# EAGLE design pcb (EAGLE 9.6.2)
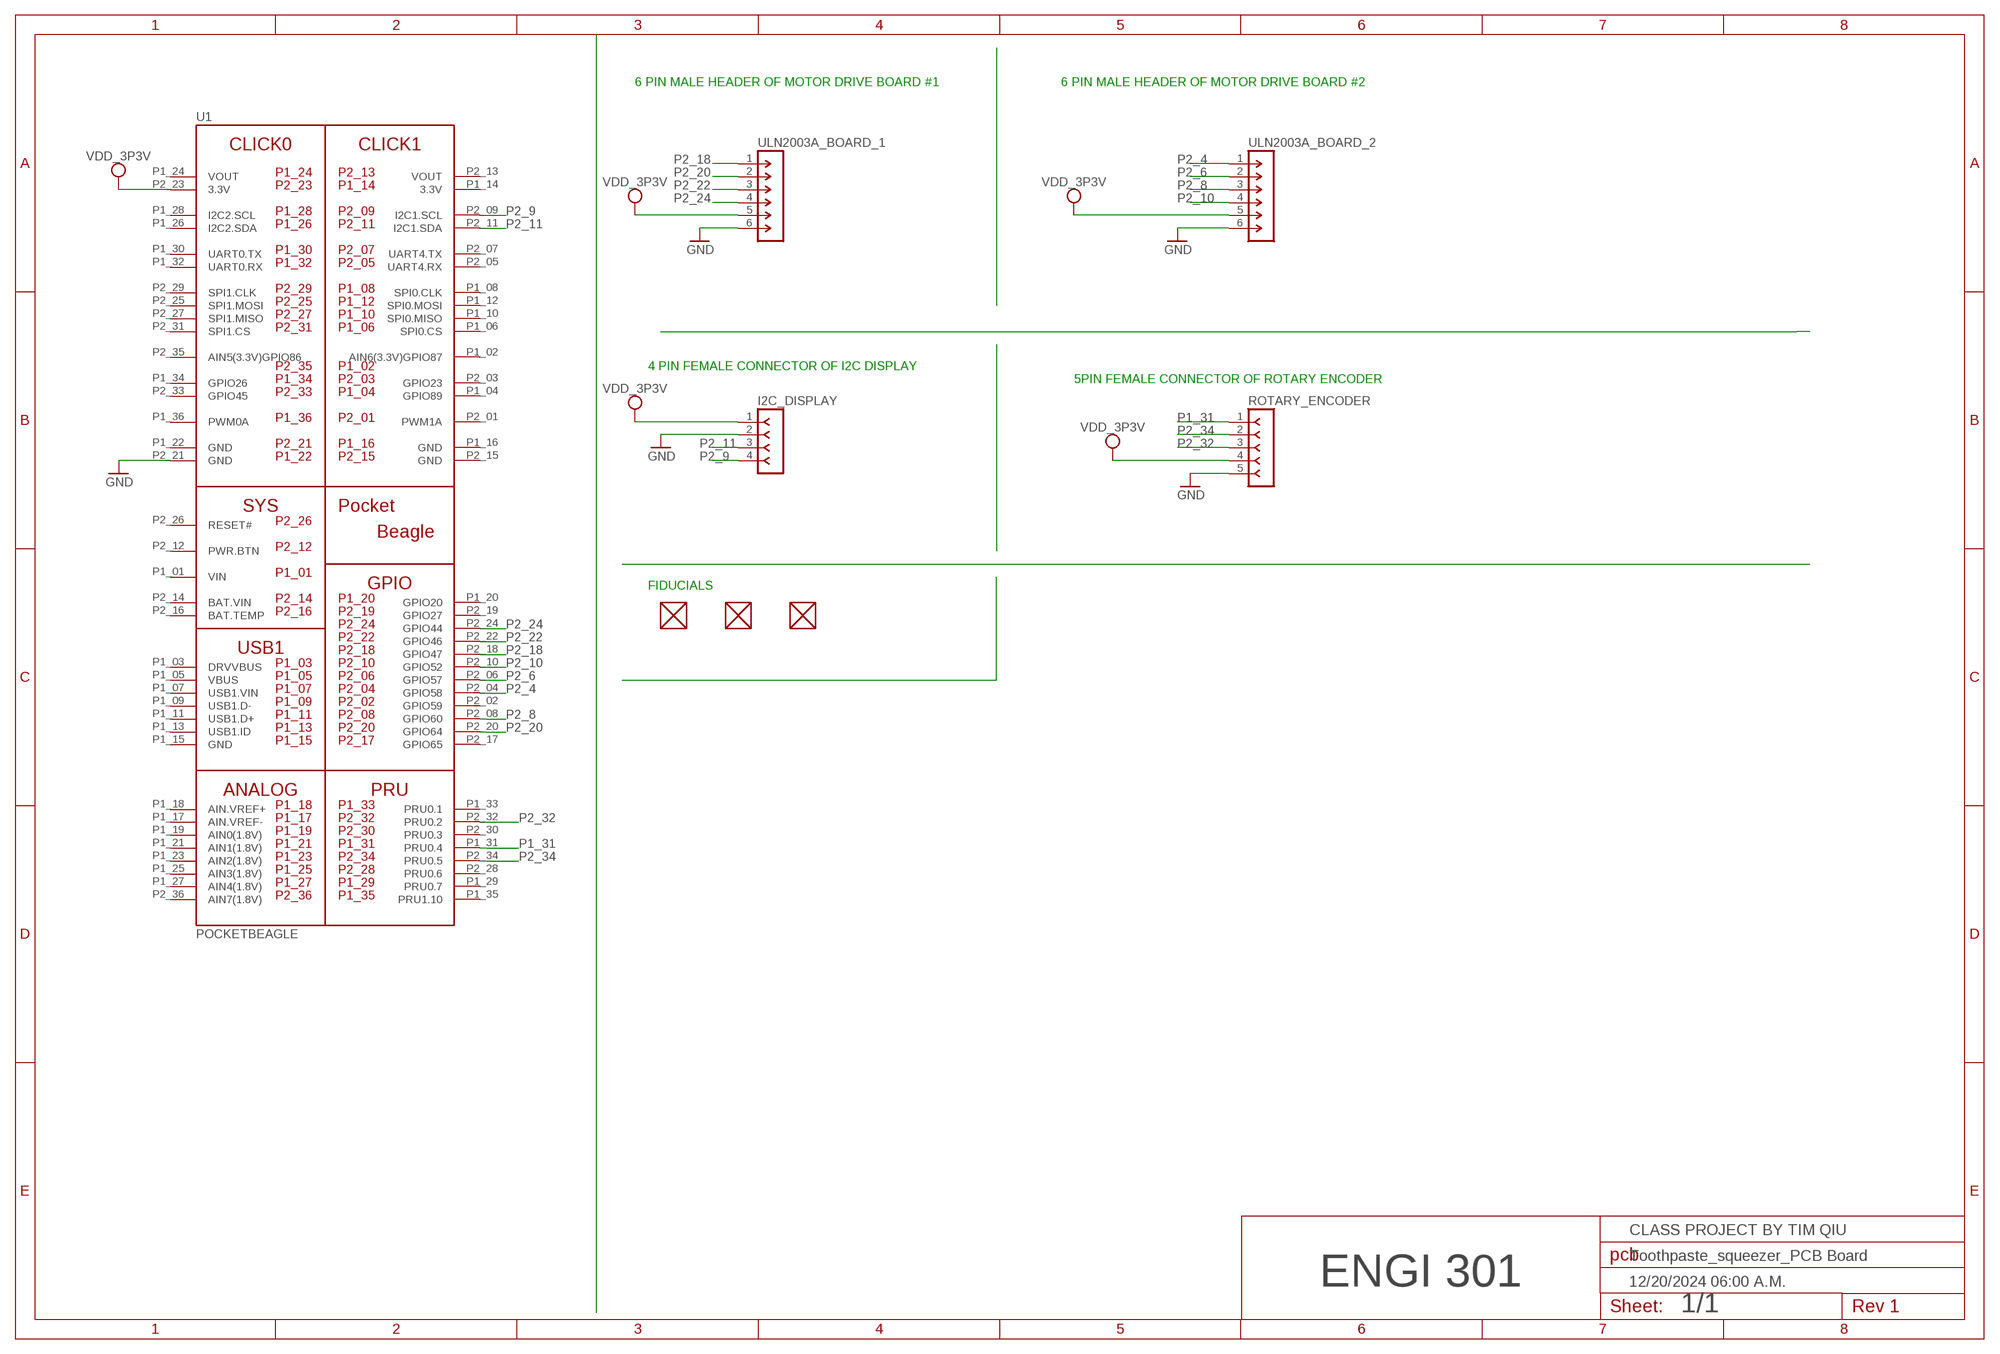
[diagram p0: schematic, sheet 1]

## Parts
FUD1  FIDUCIAL  [FIDUCIAL_40MIL]
FUD2  FIDUCIAL  [FIDUCIAL_40MIL]
FUD3  FIDUCIAL  [FIDUCIAL_40MIL]
I2C_DISPLAY  F-1X04-SIP-100-32  [SIP-100-04-32]
ROTARY_ENCODER  F-1X05-SIP-100-32  [SIP-100-05-32]
U1  POCKETBEAGLE  [POCKETBEAGLE]
ULN2003A_BOARD_1  M-1X06-SIP-100-32  [SIP-100-06-32]
ULN2003A_BOARD_2  M-1X06-SIP-100-32  [SIP-100-06-32]

## Nets
GND: I2C_DISPLAY.2 ROTARY_ENCODER.5 U1.P2_21(GND) ULN2003A_BOARD_1.6 ULN2003A_BOARD_2.6
P1_31: ROTARY_ENCODER.1 U1.P1_31(PRU0.4)
P2_4: U1.P2_04(GPIO58) ULN2003A_BOARD_2.1
P2_6: U1.P2_06(GPIO57) ULN2003A_BOARD_2.2
P2_8: U1.P2_08(GPIO60) ULN2003A_BOARD_2.3
P2_9: I2C_DISPLAY.4 U1.P2_09(I2C1.SCL)
P2_10: U1.P2_10(GPIO52) ULN2003A_BOARD_2.4
P2_11: I2C_DISPLAY.3 U1.P2_11(I2C1.SDA)
P2_18: U1.P2_18(GPIO47) ULN2003A_BOARD_1.1
P2_20: U1.P2_20(GPIO64) ULN2003A_BOARD_1.2
P2_22: U1.P2_22(GPIO46) ULN2003A_BOARD_1.3
P2_24: U1.P2_24(GPIO44) ULN2003A_BOARD_1.4
P2_32: ROTARY_ENCODER.3 U1.P2_32(PRU0.2)
P2_34: ROTARY_ENCODER.2 U1.P2_34(PRU0.5)
VDD_3P3V: I2C_DISPLAY.1 ROTARY_ENCODER.4 U1.P2_23(3.3V) ULN2003A_BOARD_1.5 ULN2003A_BOARD_2.5
Unconnected: FUD1.P$1 FUD2.P$1 FUD3.P$1 U1.P1_02(AIN6(3.3V)GPIO87) U1.P1_03(DRVVBUS) U1.P1_04(GPIO89) U1.P1_05(VBUS) U1.P1_06(SPI0.CS) U1.P1_07(USB1.VIN) U1.P1_08(SPI0.CLK) U1.P1_09(USB1.D-) U1.P1_10(SPI0.MISO) U1.P1_11(USB1.D+) U1.P1_12(SPI0.MOSI) U1.P1_13(USB1.ID) U1.P1_15(GND) U1.P1_17(AIN.VREF-) U1.P1_18(AIN.VREF+) U1.P1_19(AIN0(1.8V)) U1.P1_20(GPIO20) U1.P1_21(AIN1(1.8V)) U1.P1_23(AIN2(1.8V)) U1.P1_25(AIN3(1.8V)) U1.P1_26(I2C2.SDA) U1.P1_27(AIN4(1.8V)) U1.P1_28(I2C2.SCL) U1.P1_29(PRU0.7) U1.P1_30(UART0.TX) U1.P1_32(UART0.RX) U1.P1_33(PRU0.1) U1.P1_34(GPIO26) U1.P1_35(PRU1.10) U1.P1_36(PWM0A) U1.P2_01(PWM1A) U1.P2_02(GPIO59) U1.P2_03(GPIO23) U1.P2_05(UART4.RX) U1.P2_07(UART4.TX) U1.P2_12(PWR.BTN) U1.P2_16(BAT.TEMP) U1.P2_17(GPIO65) U1.P2_19(GPIO27) U1.P2_25(SPI1.MOSI) U1.P2_26(RESET#) U1.P2_27(SPI1.MISO) U1.P2_28(PRU0.6) U1.P2_29(SPI1.CLK) U1.P2_30(PRU0.3) U1.P2_31(SPI1.CS) U1.P2_33(GPIO45) U1.P2_35(AIN5(3.3V)GPIO86) U1.P2_36(AIN7(1.8V))

## Notes on the sheet
- 6 PIN MALE HEADER OF MOTOR DRIVE BOARD #1 | 6 PIN MALE HEADER OF MOTOR DRIVE BOARD #2
- 4 PIN FEMALE CONNECTOR OF I2C DISPLAY
- 5PIN FEMALE CONNECTOR OF ROTARY ENCODER
- FIDUCIALS
- CLASS PROJECT BY TIM QIU
- Toothpaste_squeezer_PCB Board
- ENGI 301 | 12/20/2024 06:00 A.M.
- 1/1

## Power pins joined to a net without a drawn wire
3.3V: U1.P1_14(3.3V)
BAT.VIN: U1.P2_14(BAT.VIN)
GND: U1.P1_16(GND) U1.P1_22(GND) U1.P2_15(GND)
VIN: U1.P1_01(VIN)
VOUT: U1.P1_24(VOUT) U1.P2_13(VOUT)

## Library data of the parts
FUD1-FUD3 = combo_lock:FIDUCIAL
I2C_DISPLAY = con-headers-jp:F-1X04-: FEMALE HEADER
ROTARY_ENCODER = con-headers-jp:F-1X05-: FEMALE HEADER
U1 = combo_lock:POCKETBEAGLE
ULN2003A_BOARD_1 ULN2003A_BOARD_2 = con-headers-jp:M-1X06-: MALE HEADER

## Board
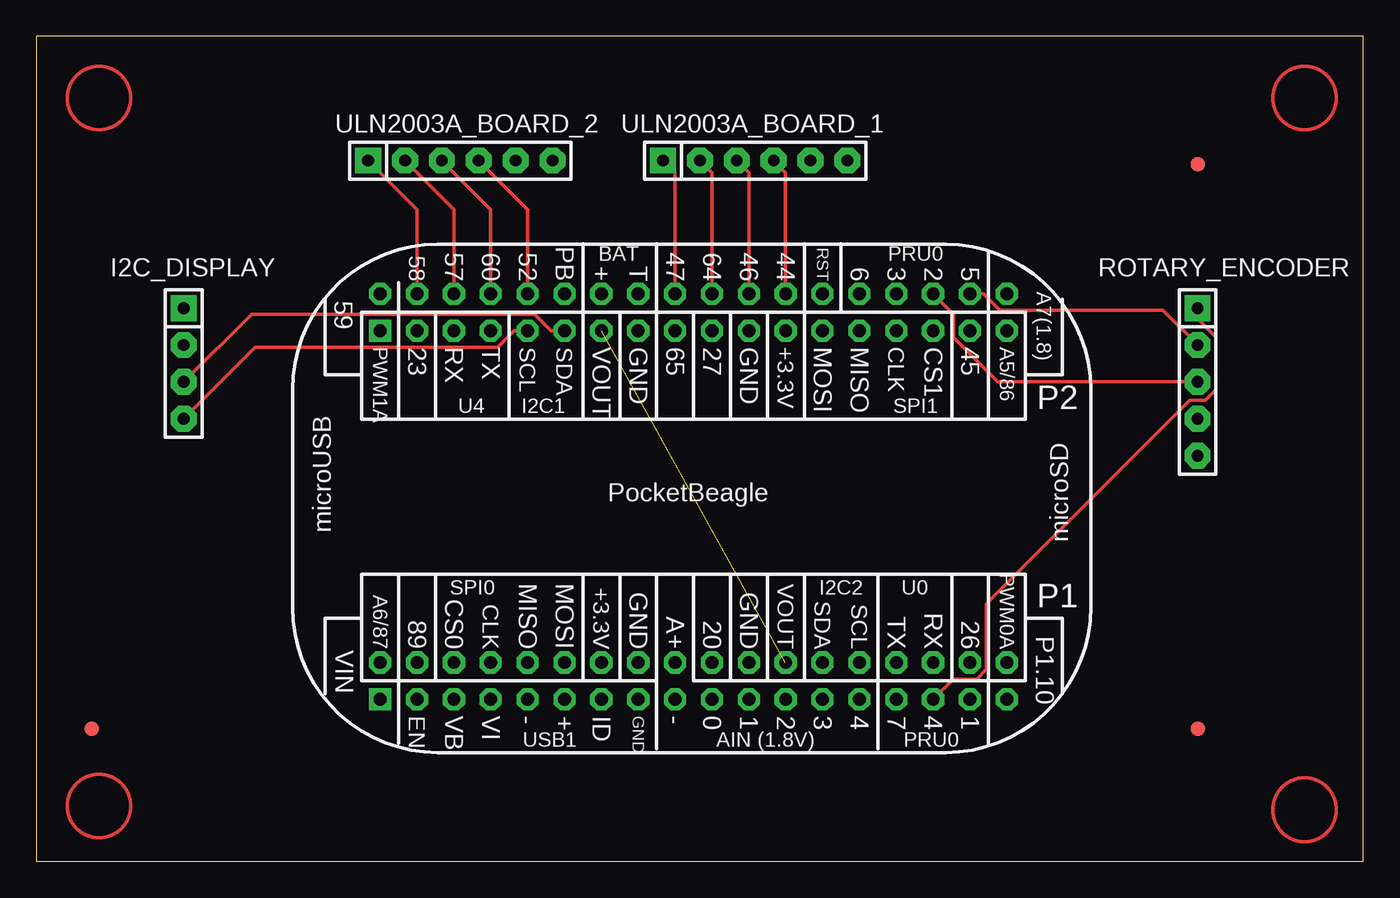
[diagram p1: board, top side]
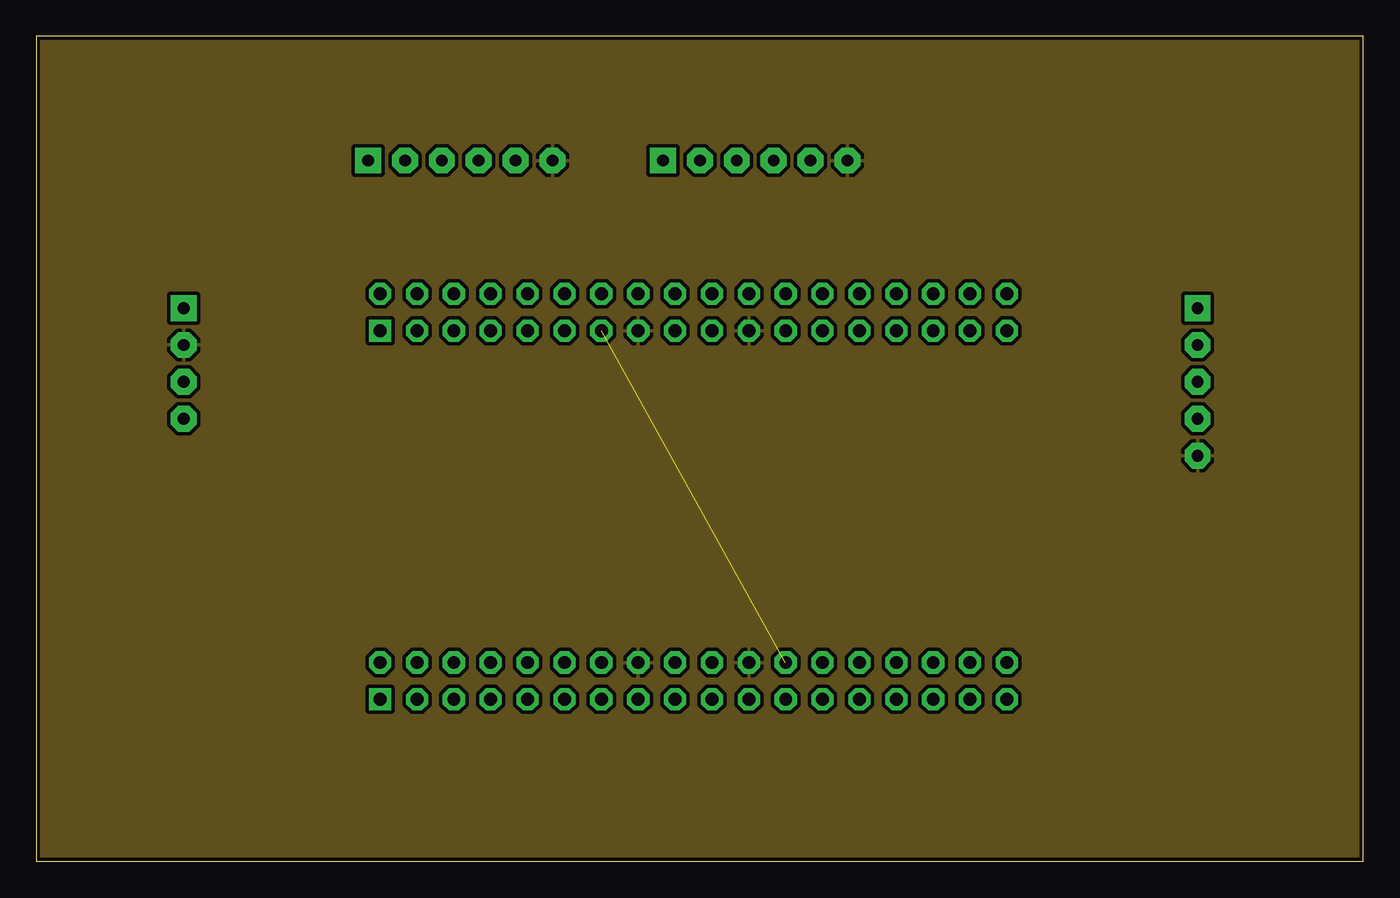
[diagram p2: board, inner layer Route2]
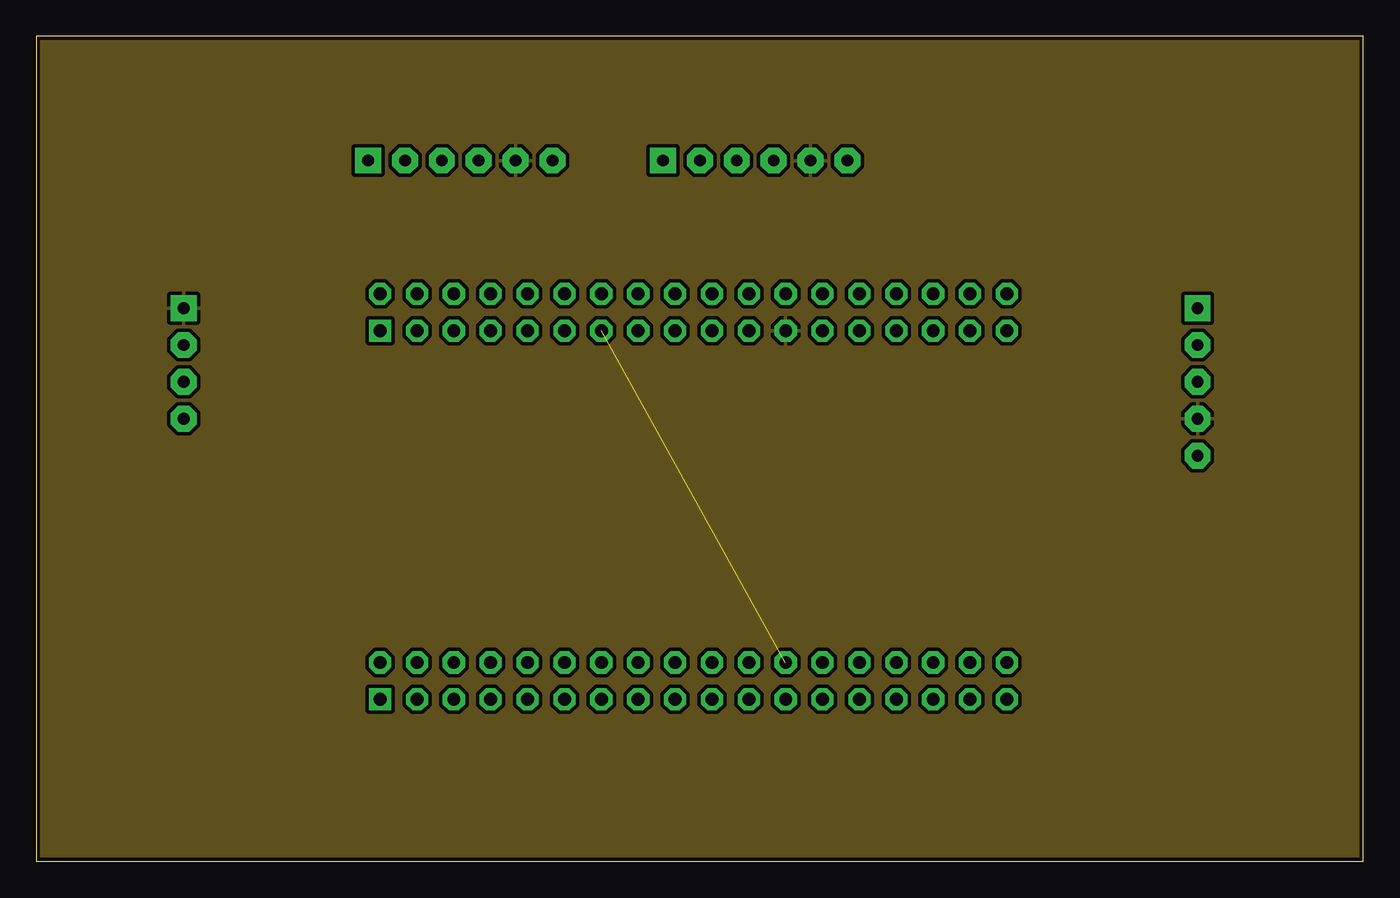
[diagram p3: board, inner layer Route15]
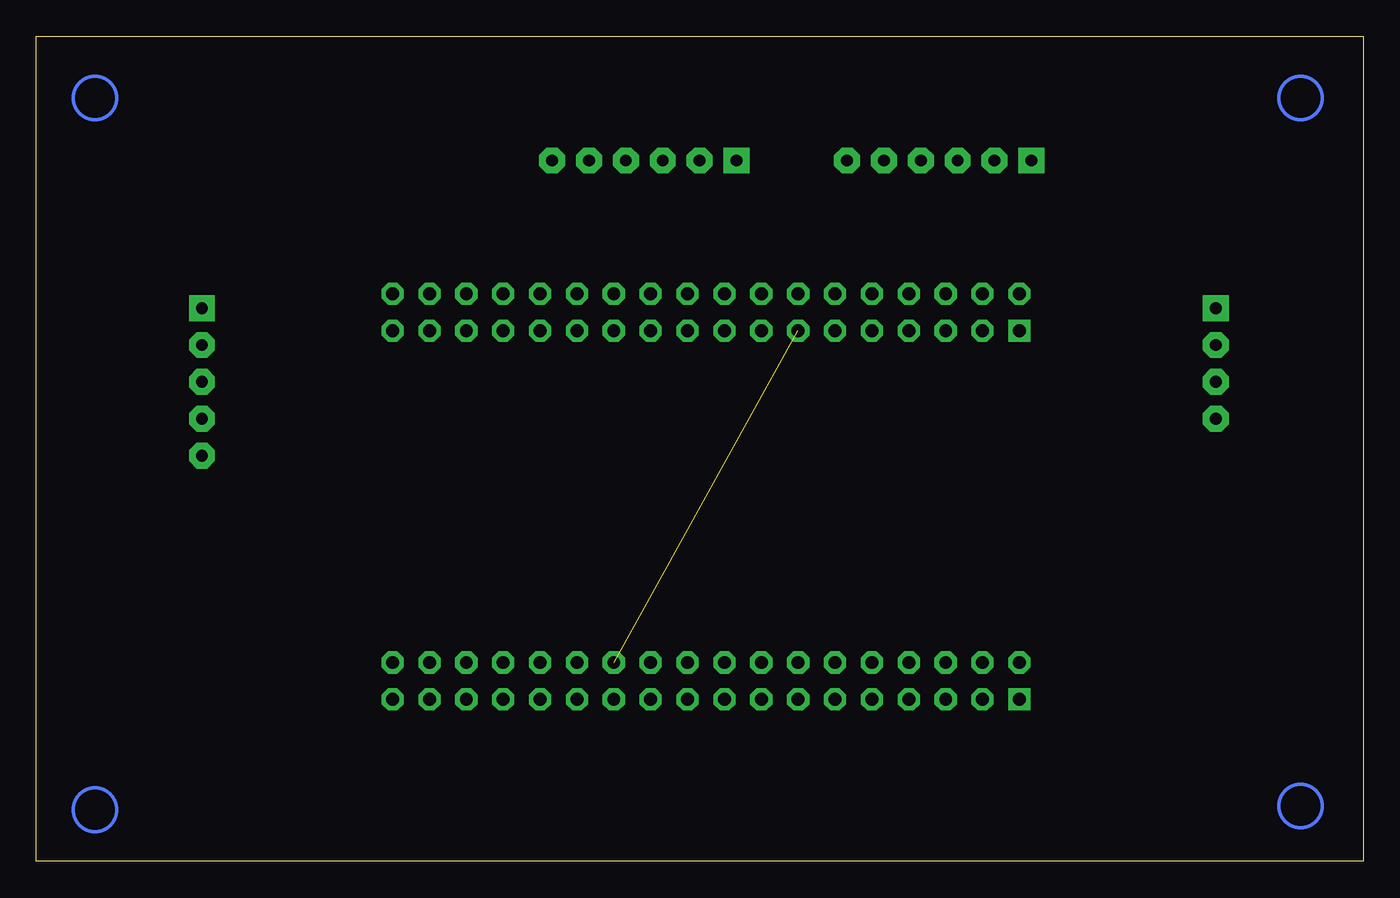
[diagram p4: board, bottom side, seen from below]

Size 91.42 x 56.82 mm. Coordinates in mm from the lower left corner, seen from the top.
Outline: 0,0 91.42,0 91.42,56.82 0,56.82 0,0
Copper layers (1*2*15*16): Top 0.035mm / dielectric 0.23mm / Route2 0.035mm / dielectric 0.93mm / Route15 0.035mm / dielectric 0.23mm / Bottom 0.035mm
Design rules "EDES301_4lyr (1)": minimum track width 10mil, minimum drill 12mil, track to track 10mil, track to pad 10mil, pad to pad 10mil, via to via 10mil, smd to smd 10mil, copper to edge 10mil, drill to drill 12mil, minimum pad ring 6mil, minimum via ring 6mil, stop-mask expansion 3mil, vias tented up to drill 25mil, thermal gap 10mil

### Footprints (pad centres in the part's own frame; a part is rotated, then mirrored left to right if it is on the bottom)
FIDUCIAL_40MIL = smd 1.016 x 1.016: P$1 0,0
SIP-100-04-32 = drill 0.813 pad 1.778 square: 1 -3.81,0 | drill 0.813 pad 1.778 octagon: 2 -1.27,0; 3 1.27,0; 4 3.81,0
SIP-100-05-32 = drill 0.813 pad 1.778 square: 1 -5.08,0 | drill 0.813 pad 1.778 octagon: 2 -2.54,0; 3 0,0; 4 2.54,0; 5 5.08,0
POCKETBEAGLE = drill 0.889 pad 1.524 square: P1_01 5.91,3.53; P2_01 5.91,28.93 | drill 0.889 pad 1.524 octagon: P1_02 5.91,6.07; P1_03 8.45,3.53; P1_04 8.45,6.07; P1_05 10.99,3.53; P1_06 10.99,6.07; P1_07 13.53,3.53; P1_08 13.53,6.07; P1_09 16.07,3.53; P1_10 16.07,6.07; P1_11 18.61,3.53; P1_12 18.61,6.07; P1_13 21.15,3.53; P1_14 21.15,6.07; P1_15 23.69,3.53; P1_16 23.69,6.07; P1_17 26.23,3.53; P1_18 26.23,6.07; P1_19 28.77,3.53; P1_20 28.77,6.07; P1_21 31.31,3.53; P1_22 31.31,6.07; P1_23 33.85,3.53; P1_24 33.85,6.07; P1_25 36.39,3.53; P1_26 36.39,6.07; P1_27 38.93,3.53; P1_28 38.93,6.07; P1_29 41.47,3.53; P1_30 41.47,6.07; P1_31 44.01,3.53; P1_32 44.01,6.07; P1_33 46.55,3.53; P1_34 46.55,6.07; P1_35 49.09,3.53; P1_36 49.09,6.07; P2_02 5.91,31.47; P2_03 8.45,28.93; P2_04 8.45,31.47; P2_05 10.99,28.93; P2_06 10.99,31.47; P2_07 13.53,28.93; P2_08 13.53,31.47; P2_09 16.07,28.93; P2_10 16.07,31.47; P2_11 18.61,28.93; P2_12 18.61,31.47; P2_13 21.15,28.93; P2_14 21.15,31.47; P2_15 23.69,28.93; P2_16 23.69,31.47; P2_17 26.23,28.93; P2_18 26.23,31.47; P2_19 28.77,28.93; P2_20 28.77,31.47; P2_21 31.31,28.93; P2_22 31.31,31.47; P2_23 33.85,28.93; P2_24 33.85,31.47; P2_25 36.39,28.93; P2_26 36.39,31.47; P2_27 38.93,28.93; P2_28 38.93,31.47; P2_29 41.47,28.93; P2_30 41.47,31.47; P2_31 44.01,28.93; P2_32 44.01,31.47; P2_33 46.55,28.93; P2_34 46.55,31.47; P2_35 49.09,28.93; P2_36 49.09,31.47
SIP-100-06-32 = drill 0.813 pad 1.778 square: 1 -6.35,0 | drill 0.813 pad 1.778 octagon: 2 -3.81,0; 3 -1.27,0; 4 1.27,0; 5 3.81,0; 6 6.35,0

### Placement (x,y rotation side)
FUD1  3.81,9.14 0 top
FUD2  80.01,9.14 0 top
FUD3  80.01,48.01 0 top
I2C_DISPLAY  10.16,34.29 270 top
ROTARY_ENCODER  80.01,33.02 270 top
U1  17.78,7.62 0 top
ULN2003A_BOARD_1  49.53,48.26 0 top
ULN2003A_BOARD_2  29.21,48.26 0 top

### Tracks (layer width: path | path; a pad name or v marks a point on that pad's centre or on a via)
GND
  pour Route2: -2.54,59.69 -2.54,-3.81 93.98,-3.81 93.98,59.69
P1_31
  Top 0.254: ROTARY_ENCODER.1 80.01,37.36 81.28,36.09 81.28,32.49 80.54,31.75 79.48,31.75 65.47,17.74 65.47,13.22 64.8,12.55 63.19,12.55 U1.P1_31
P2_4
  Top 0.254: ULN2003A_BOARD_2.1 26.23,44.89 U1.P2_04
P2_6
  Top 0.254: ULN2003A_BOARD_2.2 28.77,44.89 U1.P2_06
P2_8
  Top 0.254: ULN2003A_BOARD_2.3 31.31,44.89 U1.P2_08
P2_9
  Top 0.254: U1.P2_09 32.93,36.55 31.78,35.41 15.09,35.41 I2C_DISPLAY.4
P2_10
  Top 0.254: ULN2003A_BOARD_2.4 33.85,44.89 U1.P2_10
P2_11
  Top 0.254: U1.P2_11 35.47,36.55 34.32,37.69 14.83,37.69 I2C_DISPLAY.3
P2_18
  Top 0.254: ULN2003A_BOARD_1.1 44.01,47.43 U1.P2_18
P2_20
  Top 0.254: ULN2003A_BOARD_1.2 46.55,47.43 U1.P2_20
P2_22
  Top 0.254: ULN2003A_BOARD_1.3 49.09,47.43 U1.P2_22
P2_24
  Top 0.254: ULN2003A_BOARD_1.4 51.63,47.43 U1.P2_24
P2_32
  Top 0.254: U1.P2_32 63.19,37.69 63.19,36.08 66.24,33.02 ROTARY_ENCODER.3
P2_34
  Top 0.254: U1.P2_34 65.25,39.09 66.4,37.95 77.62,37.95 ROTARY_ENCODER.2
VDD_3P3V
  pour Route15: -5.08,60.96 -5.08,-6.35 96.52,-6.35 96.52,60.96
VOUT  (1 unrouted)
(copper drawn outside any net)
  shapes: Bottom circle x4, Top circle x4